# Altium schematic sheet Components.SchDoc: Okosotthon vezérlő HAT
size A4; Author: Bencsik Dániel Zoltán; Organization: BME VIK AUT; DocumentNumber: 3; SheetNumber: 3; SheetTotal: 4
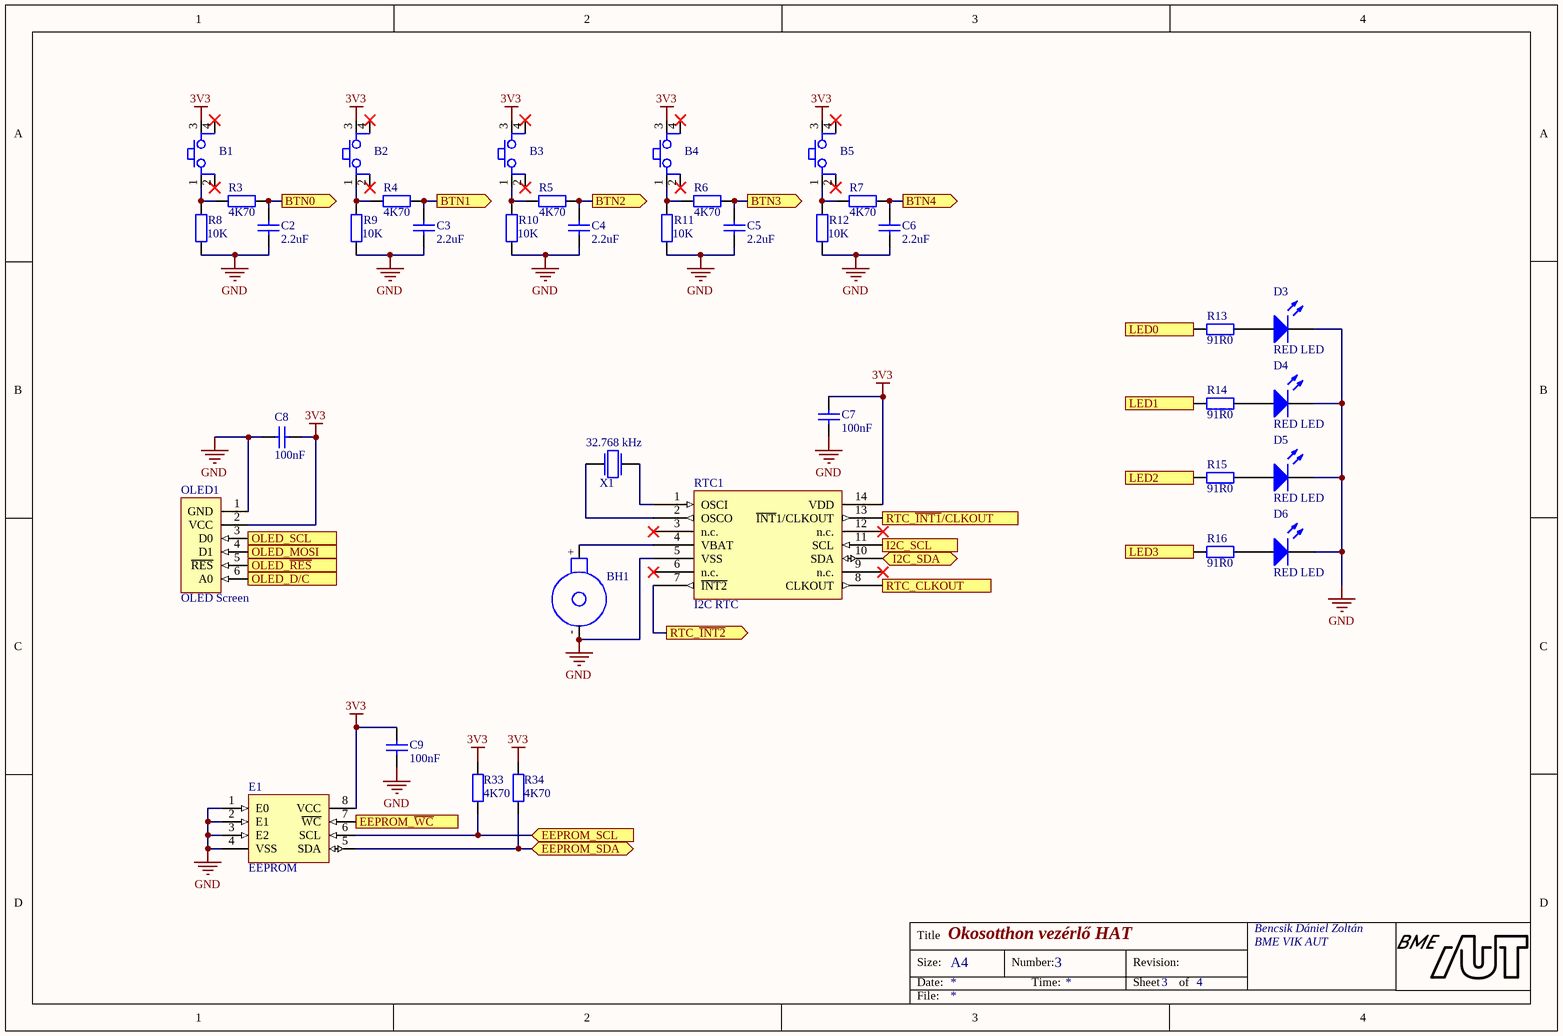
[diagram p0: Components.SchDoc]

## Parts
B1  Button  [FP_BTN_SMD]  (value not drawn)
B2  Button  [FP_BTN_SMD]  (value not drawn)
B3  Button  [FP_BTN_SMD]  (value not drawn)
B4  Button  [FP_BTN_SMD]  (value not drawn)
B5  Button  [FP_BTN_SMD]  (value not drawn)
BH1  Battery Holder  [ONLAB_ELEMTARTO]  (value not drawn)
C2  2.2uF  [FP_0805_CAP_085]
C3  2.2uF  [FP_0805_CAP_085]
C4  2.2uF  [FP_0805_CAP_085]
C5  2.2uF  [FP_0805_CAP_085]
C6  2.2uF  [FP_0805_CAP_085]
C7  100nF  [FP_0805_CAP_085]
C8  100nF  [FP_0805_CAP_085]
C9  100nF  [FP_0805_CAP_085]
D3  RED LED  [FP_0805_LED_RED]
D4  RED LED  [FP_0805_LED_RED]
D5  RED LED  [FP_0805_LED_RED]
D6  RED LED  [FP_0805_LED_RED]
E1  EEPROM  [ONLAB_M24C64-WMN6TP_SO-8_STM]
OLED1  OLED Screen  [ONLAB_OLED_D096-12864-SPI6]
R3  4K70  [FP_0805_RES]
R4  4K70  [FP_0805_RES]
R5  4K70  [FP_0805_RES]
R6  4K70  [FP_0805_RES]
R7  4K70  [FP_0805_RES]
R8  10K  [FP_0805_RES]
R9  10K  [FP_0805_RES]
R10  10K  [FP_0805_RES]
R11  10K  [FP_0805_RES]
R12  10K  [FP_0805_RES]
R13  91R0  [FP_0805_RES]
R14  91R0  [FP_0805_RES]
R15  91R0  [FP_0805_RES]
R16  91R0  [FP_0805_RES]
R33  4K70  [FP_0603_RES]
R34  4K70  [FP_0603_RES]
RTC1  I2C RTC  [ONLAB_PCF8523TS/1,118_TSSOP-14]
X1  32.768 kHz  [ONLAB_XTAL_LFXTAL050789_IQD]

## Ports
BTN0 (out), BTN1 (out), BTN2 (out), BTN3 (out), BTN4 (out), EEPROM_SCL (in), EEPROM_SDA (bidir), EEPROM_~{WC} (in), I2C_SCL (in), I2C_SDA (bidir), LED0 (in), LED1 (in), LED2 (in), LED3 (in), OLED_D/C (in), OLED_MOSI (in), OLED_SCL (in), OLED_~{RES} (in), RTC_CLKOUT (out), RTC_~{INT1}/CLKOUT (out), RTC_~{INT2} (out)

## Nets
3V3: B1.3 B2.3 B3.3 B4.3 B5.3 C7.1 C8.2 C9.1 E1.8(VCC) OLED1.2(VCC) R33.2 R34.2 RTC1.14(VDD)
GND: BH1.- C2.1 C3.1 C4.1 C5.1 C6.1 C7.2 C8.1 C9.2 D3.K D4.K D5.K D6.K E1.1(E0) E1.2(E1) E1.3(E2) E1.4(VSS) OLED1.1(GND) R8.1 R9.1 R10.1 R11.1 R12.1 RTC1.5(VSS)
BTN0: C2.2 R3.2 ; port BTN0
BTN1: C3.2 R4.2 ; port BTN1
BTN2: C4.2 R5.2 ; port BTN2
BTN3: C5.2 R6.2 ; port BTN3
BTN4: C6.2 R7.2 ; port BTN4
EEPROM_SCL: E1.6(SCL) R33.1 ; port EEPROM_SCL
EEPROM_SDA: E1.5(SDA) R34.1 ; port EEPROM_SDA
EEPROM_~{WC}: E1.7(~{WC}) ; port EEPROM_~{WC}
I2C_SCL: RTC1.11(SCL) ; port I2C_SCL
I2C_SDA: RTC1.10(SDA) ; port I2C_SDA
LED0: R13.1 ; port LED0
LED1: R14.1 ; port LED1
LED2: R15.1 ; port LED2
LED3: R16.1 ; port LED3
OLED_D/C: OLED1.6(A0) ; port OLED_D/C
OLED_MOSI: OLED1.4(D1) ; port OLED_MOSI
OLED_~{RES}: OLED1.5(~{RES}) ; port OLED_~{RES}
OLED_SCL: OLED1.3(D0) ; port OLED_SCL
RTC_CLKOUT: RTC1.8(CLKOUT) ; port RTC_CLKOUT
RTC_~{INT1}/CLKOUT: RTC1.13(~{INT}1/CLKOUT) ; port RTC_~{INT1}/CLKOUT
RTC_~{INT2}: RTC1.7(~{INT2}) ; port RTC_~{INT2}
NetB1_1: B1.1 R3.1 R8.2
NetB2_1: B2.1 R4.1 R9.2
NetB3_1: B3.1 R5.1 R10.2
NetB4_1: B4.1 R6.1 R11.2
NetB5_1: B5.1 R7.1 R12.2
NetBH1_+: BH1.+ RTC1.4(VBAT)
NetD3_A: D3.A R13.2
NetD4_A: D4.A R14.2
NetD5_A: D5.A R15.2
NetD6_A: D6.A R16.2
NetRTC1_1: RTC1.1(OSCI) X1.2
NetRTC1_2: RTC1.2(OSCO) X1.1

Not connected (* = marked no-connect by the designer): B1 2* 4*; B2 2* 4*; B3 2* 4*; B4 2* 4*; B5 2* 4*; RTC1 3(n.c.)* 6(n.c.)* 9(n.c.)* 12(n.c.)*

## Notes on the sheet
- Title
- Size:
- Date:
- A4
- Number:
- Time:
- Revision:
- Sheet
- of
- File:

## Library data of the parts
B1-B5 = Button 4P: Push button
BH1 = Battery Holder: ELEMTARTÓ 1x2032 BH2032-3P (T-T) NYÁK FEKVŐ /CR2032/
C2-C9 = CAP: Capacitor
  C2-C6: Value: 2.2uF
  C7-C9: Value: 100nF
D3-D6 = LED: Typical RED GaAs LED
E1 = EEPROM: M24C64-WMN6TP (STM) 64Kbit I2C-BUS MEM. SERIAL 8Kx8 EEPROM SO-8
OLED1 = OLED Screen: 128x64 OLED, SPI interfész
R3-R16 R33 R34 = RES: Resistor
  R3-R7 R33 R34: Value: 4K70
  R8-R12: Value: 10K
  R13-R16: Value: 91R0
RTC1 = RTC_TSSOP-14: PCF8523TS/1,118 Calendar, Clock IC, Year/Month/Week/Date/Hr/Min/Sec Binary, I2C, 1.2 V to 5.5 V, TSSOP-14
X1 = Crystal: Quarz Crystal; Value: 32.768 kHz